# EAGLE design main (EAGLE 7.2.0)
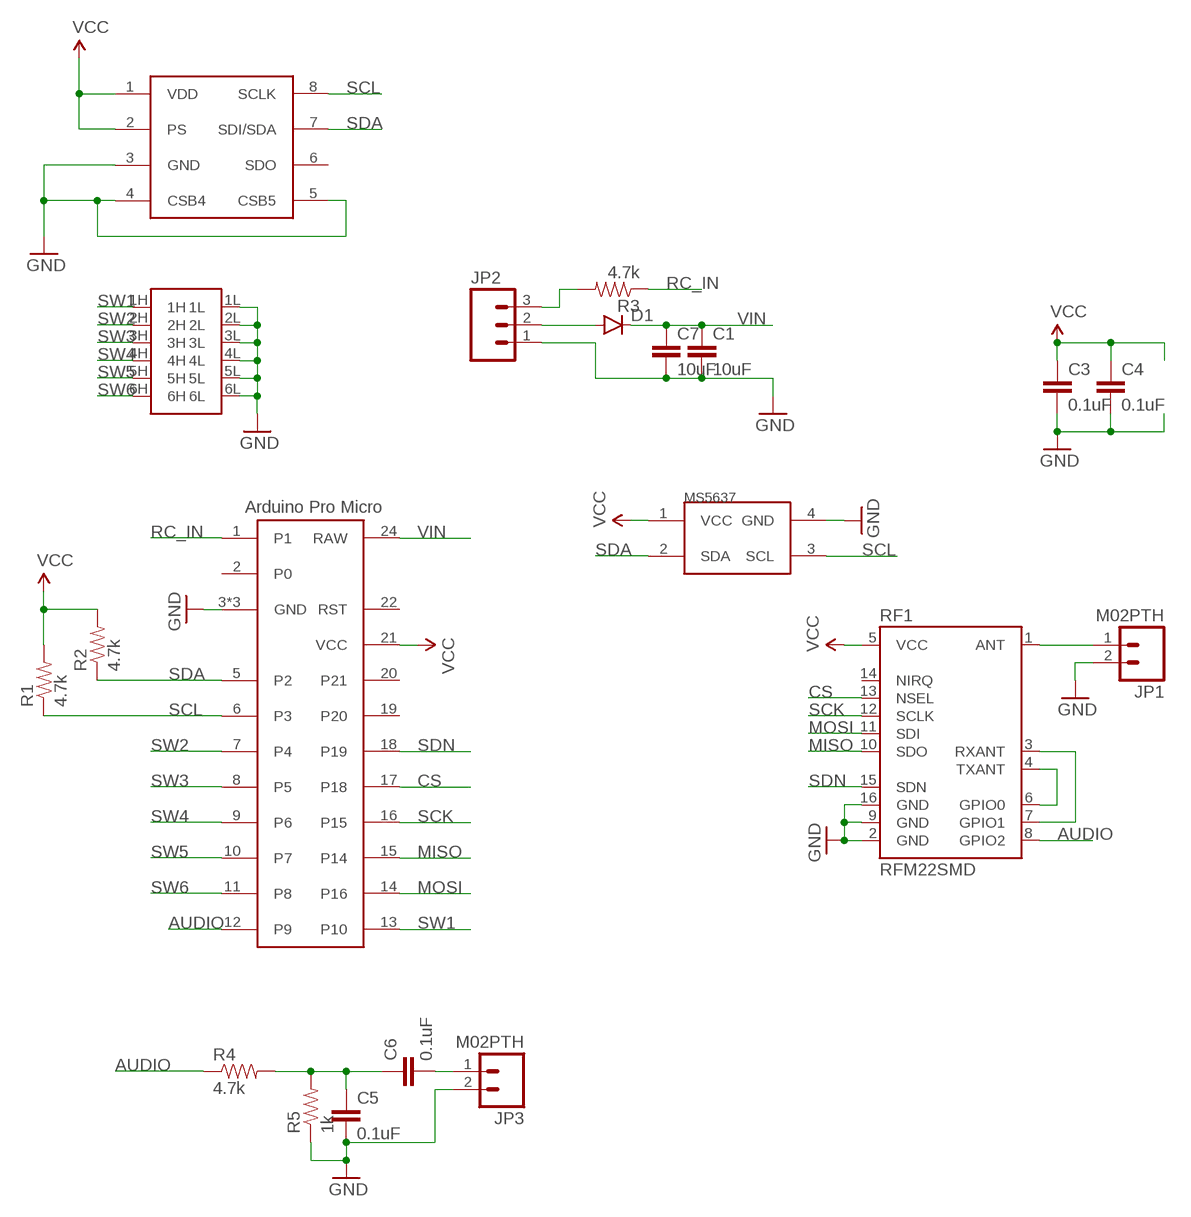
[diagram p0: schematic, sheet 1]

## Parts
C1  10uF  CAP0805  [0805]
C3  0.1uF  CAP0603-CAP  [0603-CAP]
C4  0.1uF  CAP0603-CAP  [0603-CAP]
C5  0.1uF  CAP0603-CAP  [0603-CAP]
C6  0.1uF  CAP0603-CAP  [0603-CAP]
C7  10uF  CAP0805  [0805]
D1  DIODESMA  [SMA-DIODE]
JP1  M02PTH  [1X02]
JP2  M03PTH  [1X03]
JP3  M02PTH  [1X02]
R1  4.7k  RESISTOR0603-RES  [0603-RES]
R2  4.7k  RESISTOR0603-RES  [0603-RES]
R3  4.7k  RESISTOR0603-RES  [0603-RES]
R4  4.7k  RESISTOR0603-RES  [0603-RES]
R5  1k  RESISTOR0603-RES  [0603-RES]
RF1  RFM22SMD  [RFM22-XXX-S2]
U$1  PRO_MICRO  [PRO_MICRO]
U$2  DIPSWITCH6  [DIPSWITCH6]
U$3  MS5637  [MS5637]
U$4  MS5611  [MS5611]

## Nets
AUDIO: R4.1 RF1.8(GPIO2) U$1.12(P9)
CS: RF1.13(NSEL) U$1.17(P18)
GND: C1.2 C3.2 C4.2 C5.2 C7.2 JP1.2 JP2.1 JP3.2 R5.1 RF1.2(GND) RF1.9(GND) RF1.16(GND) U$1.3(GND) U$1.4(GND) U$1.23(GND) U$2.1L U$2.2L U$2.3L U$2.4L U$2.5L U$2.6L U$3.4(GND) U$4.3(GND) U$4.4(CSB4) U$4.5(CSB5)
MISO: RF1.10(SDO) U$1.15(P14)
MOSI: RF1.11(SDI) U$1.14(P16)
N$1: JP1.1 RF1.1(ANT)
N$2: JP2.3 R3.2
N$3: D1.A JP2.2
N$4: RF1.4(TXANT) RF1.6(GPIO0)
N$5: RF1.3(RXANT) RF1.7(GPIO1)
N$7: C5.1 C6.1 R4.2 R5.2
N$8: C6.2 JP3.1
RC_IN: R3.1 U$1.1
SCK: RF1.12(SCLK) U$1.16(P15)
SCL: R1.1 U$1.6(P3) U$3.3(SCL) U$4.8(SCLK)
SDA: R2.1 U$1.5(P2) U$3.2(SDA) U$4.7(SDI/SDA)
SDN: RF1.15(SDN) U$1.18(P19)
SW1: U$1.13(P10) U$2.1H
SW2: U$1.7(P4) U$2.2H
SW3: U$1.8(P5) U$2.3H
SW4: U$1.9(P6) U$2.4H
SW5: U$1.10(P7) U$2.5H
SW6: U$1.11(P8) U$2.6H
VCC: C3.1 C4.1 R1.2 R2.2 RF1.5(VCC) U$1.21(VCC) U$3.1(VCC) U$4.1(VDD) U$4.2(PS)
VIN: C1.1 C7.1 D1.C U$1.24(RAW)
Unconnected: RF1.14(NIRQ) U$1.2(P0) U$1.19(P20) U$1.20(P21) U$1.22(RST) U$4.6(SDO)

## Library data of the parts
C1 C3-C7 = SparkFun-Passives:CAP: Capacitor Standard 0603 ceramic capacitor, and 0.1" leaded capacitor.
D1 = SparkFun-DiscreteSemi:DIODE: Diode These are standard reverse protection diodes and small signal diodes. SMA package can handle up to about 1A. SOD-323 can handle about 200mA. What the SOD-323 package when ordering, there are some mfgs out there that are 5-pin packages.
JP1 JP3 = SparkFun-Connectors:M02: Standard 2-pin 0.1" header. Use with - straight break away headers ( PRT-00116) - right angle break away headers (PRT-00553) - swiss pins (PRT-00743) - machine pins (PRT-00117) - female headers (PRT-00115) Molex polarized connector foot print use with: PRT-08233 with associated crimp pins and housings. 2.54_SCREWTERM for use with PRT-10571. 3.5mm Screw Terminal footprints for PRT-08084 5mm Screw Terminal footprints for use with PRT-08432
JP2 = SparkFun-Connectors:M03: Header 3 Standard 3-pin 0.1" header. Use with straight break away headers (SKU : PRT-00116), right angle break away headers (PRT-00553), swiss pins (PRT-00743), machine pins (PRT-00117), and female headers (PRT-00115). Molex polarized connector foot print use with SKU : PRT-08232 with associated crimp pins and housings.
R1-R5 = SparkFun-Passives:RESISTOR: Resistor Basic schematic elements and footprints for 0603, 1206, and PTH resistors.
RF1 = SparkFun-RF:RFM22: The RFM22 is a low-power, low cost radio that is capable of operating in the 434MHz and 900MHz open bands. It's frequency is software defined and there are some very good libraries written for it.
U$1 = Custom_old:PRO_MICRO
U$2 = Custom_old:DIPSWITCH6
U$3 = Custom_old:MS5637
U$4 = Custom_old:MS5611

## Board
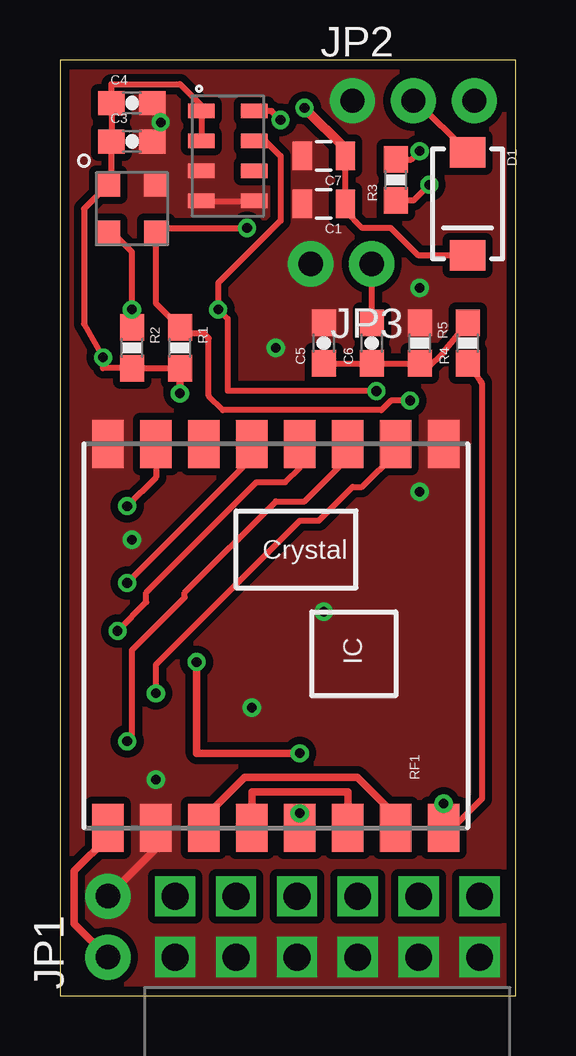
[diagram p1: board, top side]
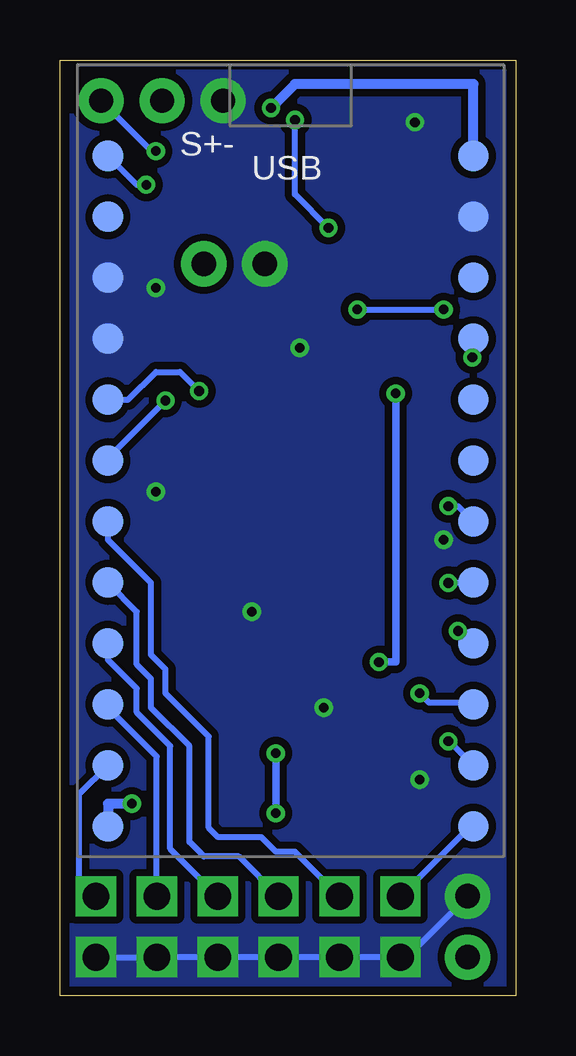
[diagram p2: board, bottom side, seen from below]

Size 19 x 39 mm. Coordinates in mm from the lower left corner, seen from the top.
Outline: 0,0 19,0 19,39 0,39 0,0
Copper layers (1*16): Top 0.0356mm / dielectric 1.5011mm / Bottom 0.0356mm
Design rules "patrick": minimum track width 6mil, minimum drill 13mil, track to track 6mil, track to pad 6mil, pad to pad 6mil, via to via 6mil, smd to smd 6mil, copper to edge 15mil, drill to drill 6mil, minimum pad ring 7mil, minimum via ring 7mil, stop-mask expansion 3mil, vias tented up to drill 25mil, thermal gap 10mil

### Footprints (pad centres in the part's own frame; a part is rotated, then mirrored left to right if it is on the bottom)
0805 = smd 0.8 x 1.2: 1 -0.9,0; 2 0.9,0
0603-CAP = smd 1.1 x 1: 1 -0.85,0; 2 0.85,0
SMA-DIODE = smd 1.27 x 1.47: A -2.15,0; C 2.15,0
1X02 = drill 1.016 pad 1.88: 1 0,0; 2 2.54,0
1X03 = drill 1.016 pad 1.88: 1 0,0; 2 2.54,0; 3 5.08,0
0603-RES = smd 1.1 x 1: 1 -0.85,0; 2 0.85,0
RFM22-XXX-S2 = smd 2 x 1.3: 1 -8,7; 2 -8,5; 3 -8,3; 4 -8,1; 5 -8,-1; 6 -8,-3; 7 -8,-5; 8 -8,-7; 9 8,-7; 10 8,-5; 11 8,-3; 12 8,-1; 13 8,1; 14 8,3; 15 8,5; 16 8,7
PRO_MICRO = smd 1.27 x 1.27: 1 0,0; 2 0,-2.54; 3 0,-5.08; 4 0,-7.62; 5 0,-10.16; 6 0,-12.7; 7 0,-15.24; 8 0,-17.78; 9 0,-20.32; 10 0,-22.86; 11 0,-25.4; 12 0,-27.94; 13 15.24,-27.94; 14 15.24,-25.4; 15 15.24,-22.86; 16 15.24,-20.32; 17 15.24,-17.78; 18 15.24,-15.24; 19 15.24,-12.7; 20 15.24,-10.16; 21 15.24,-7.62; 22 15.24,-5.08; 23 15.24,-2.54; 24 15.24,0
DIPSWITCH6 = drill 1.118 square: 1H 0,2.54; 1L 0,0; 2H 2.54,2.54; 2L 2.54,0; 3H 5.08,2.54; 3L 5.08,0; 4H 7.62,2.54; 4L 7.62,0; 5H 10.16,2.54; 5L 10.16,0; 6H 12.7,2.54; 6L 12.7,0
MS5637 = smd 1 x 1: 1 -1,1; 2 -1,-1; 3 1,-1; 4 1,1
MS5611 = smd 1.1 x 0.6: 1 -1.1,1.875; 2 -1.1,0.625; 3 -1.1,-0.625; 4 -1.1,-1.875; 5 1.1,-1.875; 6 1.1,-0.625; 7 1.1,0.625; 8 1.1,1.875

### Placement (x,y rotation side)
C1  11,33 180 top
C3  3,35.6 0 top
C4  3,37.2 0 top
C5  11,27.2 90 top
C6  13,27.2 90 top
C7  11,35 180 top
D1  17,33 270 top
JP1  2,1.6 90 top
JP2  12.2,37.3 0 top
JP3  13,30.5 180 top
R1  5,27 270 top
R2  3,27 270 top
R3  14,34 90 top
R4  17,27.2 90 top
R5  15,27.2 270 top
RF1  9,15 90 top
U$1  17,35 0 bottom
U$2  4.8,1.6 0 top
U$3  3,32.8 0 top
U$4  7,35 0 top

### Tracks (layer width: path | path; a pad name or v marks a point on that pad's centre or on a via)
AUDIO  (via drill 0.4)
  Top 0.254: R4.1 17.53,25.62 arc-45 17.6,25.45 17.6,8.2 16.47,7.07 arc-45 16.3,7 RF1.8
  Top 0.406: RF1.8 v16,8
  Bottom 0.406: v16,8 17,8 U$1.12
CS  (via drill 0.4)
  Top 0.254: v2.8,17.2 8,22.4 RF1.13
  Bottom 0.254: U$1.17 1.78,17.2 v2.8,17.2
GND  (via drill 0.4)
  Top 0.254: U$4.4 U$4.5
  Top 0.305: JP1.2 4,6.14 RF1.2
  Bottom 0.254: U$2.6L U$2.5L U$2.4L U$2.3L U$2.2L U$2.1L 4.54,1.6 JP1.2
  other vias: 15,21 4.2,36.4 3,19 8,12 4,9 15,29.5 9,27 11,16
  pour Top (isolate 0.305, no thermals): 0,39 0,0 19,0 19,39
  pour Bottom (isolate 0.305, no thermals): 0,39 0,0 19,0 19,39
MISO  (via drill 0.4)
  Top 0.254: v4,12.6 4,13.8 10,19.8 10.8,19.8 12.2,21.2 12.6,21.2 14,22.6 RF1.10
  Bottom 0.254: U$1.15 1.82,12.2 3.6,12.2 v4,12.6
MOSI  (via drill 0.4)
  Top 0.254: v2.8,10.6 3,10.8 3,14.4 5.2,16.6 5.2,16.8 9,20.6 10.2,20.6 12,22.4 RF1.11
  Bottom 0.254: U$1.14 2.76,10.6 v2.8,10.6
N$1
  Top 0.305: JP1.1 0.6,3 0.6,5.2 2,6.6 RF1.1
N$2  (via drill 0.4)
  Top 0.254: R3.2 14.65,34.85 v15,35.2
  Bottom 0.254: v15,35.2 15.18,35.2 JP2.3
N$3
  Top 0.254: JP2.2 14.85,37.3 D1.A
N$4
  Top 0.305: RF1.4 8,8.5 12,8.5 RF1.6
N$5
  Top 0.305: RF1.7 14,7.5 12.4,9.1 7.7,9.1 6,7.4 RF1.3
N$7
  Top 0.254: C5.1 C6.1 R5.2 15.35,26.15 16,26.8 16,26.85 R4.2
N$8
  Top 0.254: C6.2 JP3.1
RC_IN  (via drill 0.4)
  Top 0.254: R3.1 14.75,33.15 v15.4,33.8
  Bottom 0.254: v15.4,33.8 15.8,33.8 U$1.1
SCK  (via drill 0.4)
  Top 0.254: v2.4,15.2 3.6,16.4 3.6,16.8 8.2,21.4 9.4,21.4 10,22 RF1.12
  Bottom 0.254: U$1.16 2.28,15.2 v2.4,15.2
SCL  (via drill 0.4)
  Top 0.254: v14.6,24.8 13.8,24.8 13.4,24.4 6.8,24.4 6.2,25 6.2,27.4 6,27.6 5.25,27.6 R1.1 4,28.85 U$3.3 4.2,32 v7.8,32 | v9.2,36.5 8.82,36.88 U$4.8
  Bottom 0.254: U$1.6 17,22.4 v14.6,24.8 | v7.8,32 9.2,33.4 v9.2,36.5
SDA  (via drill 0.4)
  Top 0.254: R2.1 v3,28.6 3,31 2.2,31.8 U$3.2 | v13.2,25.2 7,25.2 7,28.2 v6.6,28.6 6.6,29.7 9.2,32.3 9.2,35 8.57,35.62 U$4.7
  Bottom 0.254: U$1.5 16.16,24.84 15,26 14,26 v13.2,25.2 | v6.6,28.6 v3,28.6
SDN  (via drill 0.4)
  Top 0.254: RF1.15 4,21.6 v2.8,20.4
  Bottom 0.254: v2.8,20.4 2.4,20.4 U$1.18
SW1
  Bottom 0.254: U$2.1H 1.88,7.06 U$1.13
SW2
  Bottom 0.254: U$2.2H 9.2,6 10,6 10.6,6.6 12.4,6.6 12.8,7 12.8,10.8 14.6,12.6 14.6,13.6 15.2,14.2 15.2,17.2 17,19 U$1.7
SW3
  Bottom 0.254: U$2.3H 11.54,5.8 13,5.8 13.6,6.4 13.6,10.4 15.2,12 15.2,13.2 15.8,13.8 15.8,16 17,17.2 U$1.8
SW4
  Bottom 0.254: U$2.4H 14.4,6.12 14.4,10.4 15.8,11.8 15.8,12.8 17,14 U$1.9
SW5
  Bottom 0.254: U$2.5H 14.96,9.96 17,12 U$1.10
SW6
  Bottom 0.254: U$2.6H 18.2,4.14 18.2,8.4 U$1.11
VCC  (via drill 0.4)
  Top 0.254: U$4.2 U$4.1 5.9,37.1 5,38 2.15,38 C4.1 C3.1 2.15,34.05 arc-45 2.08,33.88 U$3.1 1,32.8 1,28 v1.8,26.6 1.8,26.15 R2.2 R1.2
  Top 0.305: RF1.5 v10,7.6 | v10,10.1 5.7,10.1 v5.7,13.9 | v5,25.1 R1.2
  Bottom 0.254: v1.8,26.6 1.76,26.6 U$1.21
  Bottom 0.305: v10,7.6 v10,10.1 | v5.7,13.9 5,13.9 v5,25.1
VIN  (via drill 0.4)
  Top 0.254: D1.C 14.95,30.85 13.8,32 12.6,32 11.9,32.7 C1.1 C7.1
  Top 0.406: v10.2,37 11.9,35.3 C7.1
  Bottom 0.406: U$1.24 1.76,38 9.2,38 v10.2,37

### Text on the board
bPlace: S+- | USB